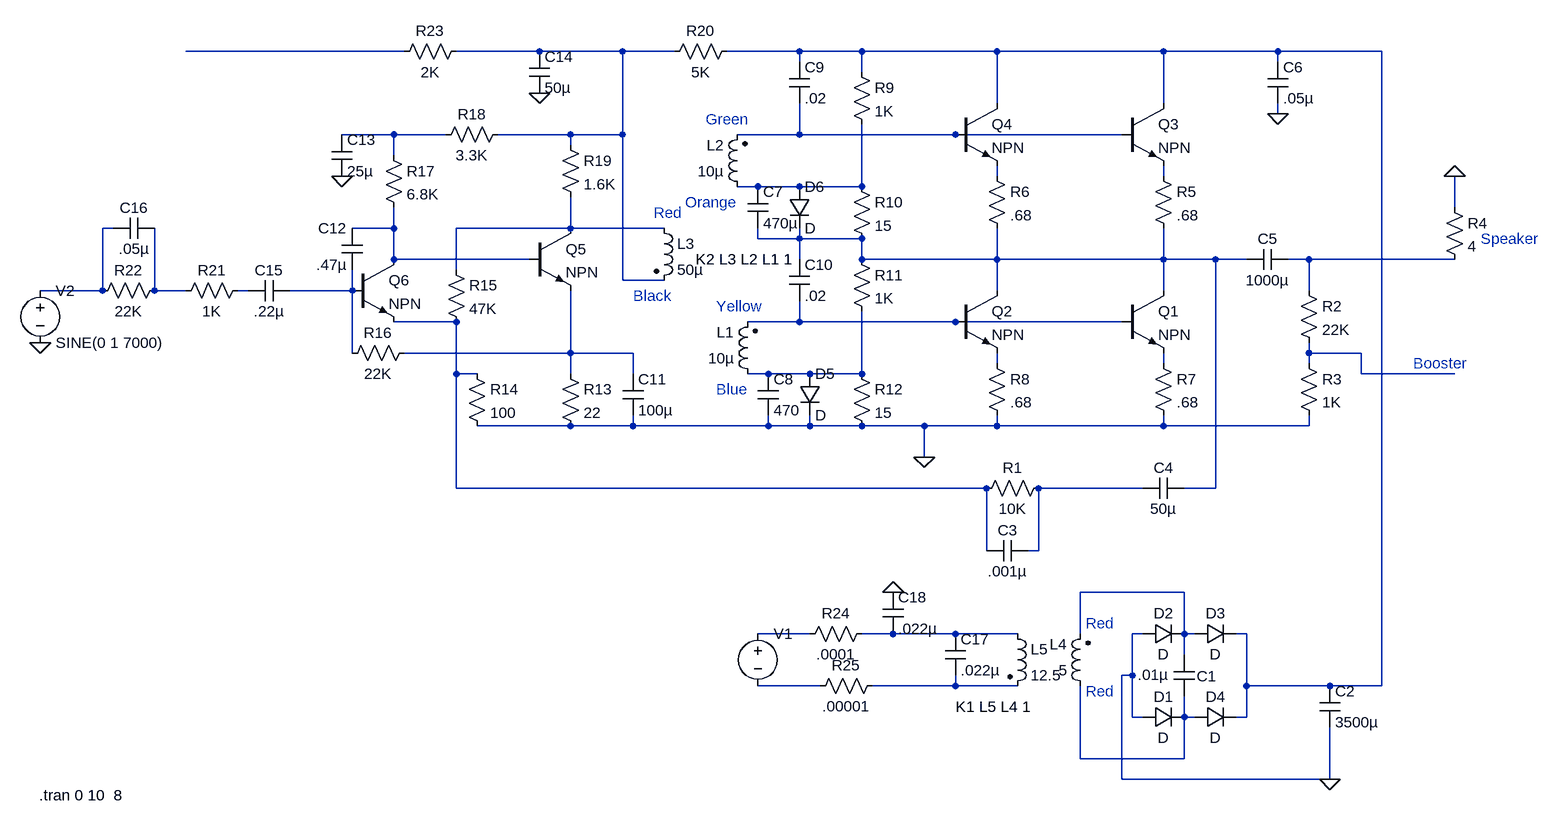
[diagram p0: schematic PA120_power.asc]
PA120_power.asc, the LTspice schematic file:
Version 4
SHEET 1 984 692
WIRE -784 -1568 -1120 -1568
WIRE -576 -1568 -704 -1568
WIRE -448 -1568 -576 -1568
WIRE -368 -1568 -448 -1568
WIRE -176 -1568 -288 -1568
WIRE -80 -1568 -176 -1568
WIRE 128 -1568 -80 -1568
WIRE 384 -1568 128 -1568
WIRE 560 -1568 384 -1568
WIRE 720 -1568 560 -1568
WIRE -176 -1552 -176 -1568
WIRE 560 -1552 560 -1568
WIRE -80 -1536 -80 -1568
WIRE 128 -1488 128 -1568
WIRE 384 -1488 384 -1568
WIRE 560 -1472 560 -1488
WIRE -800 -1440 -880 -1440
WIRE -720 -1440 -800 -1440
WIRE -528 -1440 -640 -1440
WIRE -448 -1440 -448 -1568
WIRE -448 -1440 -528 -1440
WIRE -176 -1440 -176 -1488
WIRE -176 -1440 -272 -1440
WIRE 64 -1440 -176 -1440
WIRE 320 -1440 64 -1440
WIRE -528 -1424 -528 -1440
WIRE -800 -1408 -800 -1440
WIRE 128 -1376 128 -1392
WIRE 384 -1376 384 -1392
WIRE -240 -1360 -272 -1360
WIRE -176 -1360 -240 -1360
WIRE -80 -1360 -80 -1456
WIRE -80 -1360 -176 -1360
WIRE 832 -1328 832 -1376
WIRE -1232 -1296 -1248 -1296
WIRE -800 -1296 -800 -1328
WIRE -800 -1296 -864 -1296
WIRE -528 -1296 -528 -1344
WIRE -528 -1296 -704 -1296
WIRE -384 -1296 -528 -1296
WIRE -240 -1280 -240 -1296
WIRE -176 -1280 -176 -1296
WIRE -176 -1280 -240 -1280
WIRE -80 -1280 -176 -1280
WIRE -800 -1248 -800 -1296
WIRE -592 -1248 -800 -1248
WIRE -176 -1248 -176 -1280
WIRE -80 -1248 -80 -1280
WIRE 128 -1248 128 -1296
WIRE 128 -1248 -80 -1248
WIRE 384 -1248 384 -1296
WIRE 384 -1248 128 -1248
WIRE 464 -1248 384 -1248
WIRE 512 -1248 464 -1248
WIRE 608 -1248 576 -1248
WIRE 832 -1248 608 -1248
WIRE -704 -1232 -704 -1296
WIRE -448 -1216 -448 -1440
WIRE -384 -1216 -448 -1216
WIRE -1248 -1200 -1248 -1296
WIRE -1248 -1200 -1344 -1200
WIRE -1168 -1200 -1168 -1296
WIRE -1120 -1200 -1168 -1200
WIRE -1024 -1200 -1040 -1200
WIRE -864 -1200 -864 -1232
WIRE -864 -1200 -960 -1200
WIRE 128 -1200 128 -1248
WIRE 384 -1200 384 -1248
WIRE 608 -1200 608 -1248
WIRE -704 -1152 -800 -1152
WIRE -176 -1152 -176 -1184
WIRE -176 -1152 -256 -1152
WIRE 64 -1152 -176 -1152
WIRE 320 -1152 64 -1152
WIRE -864 -1104 -864 -1200
WIRE -528 -1104 -528 -1200
WIRE -528 -1104 -784 -1104
WIRE -432 -1104 -528 -1104
WIRE 608 -1104 608 -1120
WIRE 688 -1104 608 -1104
WIRE 128 -1088 128 -1104
WIRE 384 -1088 384 -1104
WIRE 608 -1088 608 -1104
WIRE -704 -1072 -704 -1152
WIRE -672 -1072 -704 -1072
WIRE -528 -1072 -528 -1104
WIRE -432 -1072 -432 -1104
WIRE -224 -1072 -256 -1072
WIRE -160 -1072 -224 -1072
WIRE -80 -1072 -80 -1168
WIRE -80 -1072 -160 -1072
WIRE 688 -1072 688 -1104
WIRE 832 -1072 688 -1072
WIRE -528 -992 -672 -992
WIRE -432 -992 -432 -1008
WIRE -432 -992 -528 -992
WIRE -224 -992 -224 -1008
WIRE -224 -992 -432 -992
WIRE -160 -992 -160 -1008
WIRE -160 -992 -224 -992
WIRE -80 -992 -160 -992
WIRE 16 -992 -80 -992
WIRE 128 -992 128 -1008
WIRE 128 -992 16 -992
WIRE 384 -992 384 -1008
WIRE 384 -992 128 -992
WIRE 608 -992 608 -1008
WIRE 608 -992 384 -992
WIRE 16 -944 16 -992
WIRE -704 -896 -704 -1072
WIRE 112 -896 -704 -896
WIRE 352 -896 192 -896
WIRE 464 -896 464 -1248
WIRE 464 -896 416 -896
WIRE 112 -800 112 -896
WIRE 192 -800 192 -896
WIRE 192 -800 176 -800
WIRE 416 -736 256 -736
WIRE -160 -672 -240 -672
WIRE -32 -672 -80 -672
WIRE 64 -672 -32 -672
WIRE 160 -672 64 -672
WIRE 256 -672 256 -736
WIRE 352 -672 336 -672
WIRE 416 -672 416 -736
WIRE 432 -672 416 -672
WIRE 512 -672 496 -672
WIRE 416 -640 416 -672
WIRE 336 -608 336 -672
WIRE 336 -608 320 -608
WIRE -144 -592 -240 -592
WIRE 64 -592 64 -608
WIRE 64 -592 -64 -592
WIRE 160 -592 64 -592
WIRE 512 -592 512 -672
WIRE 640 -592 512 -592
WIRE 720 -592 720 -1568
WIRE 720 -592 640 -592
WIRE 336 -544 336 -608
WIRE 352 -544 336 -544
WIRE 416 -544 416 -576
WIRE 432 -544 416 -544
WIRE 512 -544 512 -592
WIRE 512 -544 496 -544
WIRE 256 -480 256 -592
WIRE 416 -480 416 -544
WIRE 416 -480 256 -480
WIRE 320 -448 320 -608
WIRE 640 -448 640 -528
WIRE 640 -448 320 -448
FLAG 640 -448 0
FLAG 832 -1376 0
FLAG 16 -944 0
FLAG 560 -1472 0
FLAG -880 -1376 0
FLAG -576 -1504 0
FLAG -32 -736 0
FLAG -1344 -1120 0
SYMBOL diode 352 -528 R270
WINDOW 0 32 32 VTop 0
WINDOW 3 0 32 VBottom 0
SYMATTR InstName D1
SYMBOL diode 352 -656 R270
WINDOW 0 32 32 VTop 0
WINDOW 3 0 32 VBottom 0
SYMATTR InstName D2
SYMBOL diode 432 -656 R270
WINDOW 0 32 32 VTop 0
WINDOW 3 0 32 VBottom 0
SYMATTR InstName D3
SYMBOL diode 432 -528 R270
WINDOW 0 32 32 VTop 0
WINDOW 3 0 32 VBottom 0
SYMATTR InstName D4
SYMBOL cap 400 -640 R0
WINDOW 0 35 33 Left 0
WINDOW 3 -56 31 Left 0
SYMATTR InstName C1
SYMATTR Value .01µ
SYMATTR SpiceLine V=1000
SYMBOL cap 624 -592 R0
SYMATTR InstName C2
SYMATTR Value 3500µ
SYMATTR SpiceLine V=80
SYMBOL cap 176 -816 R90
WINDOW 0 0 32 VBottom 0
WINDOW 3 32 32 VTop 0
SYMATTR InstName C3
SYMATTR Value .001µ
SYMBOL res 208 -912 R90
WINDOW 0 0 56 VBottom 0
WINDOW 3 32 56 VTop 0
SYMATTR InstName R1
SYMATTR Value 10K
SYMBOL cap 416 -912 R90
WINDOW 0 0 32 VBottom 0
WINDOW 3 32 32 VTop 0
SYMATTR InstName C4
SYMATTR Value 50µ
SYMATTR SpiceLine V=50
SYMBOL cap 576 -1264 R90
WINDOW 0 0 32 VBottom 0
WINDOW 3 32 32 VTop 0
SYMATTR InstName C5
SYMATTR Value 1000µ
SYMATTR SpiceLine V=50
SYMBOL res 592 -1216 R0
SYMATTR InstName R2
SYMATTR Value 22K
SYMBOL res 592 -1104 R0
SYMATTR InstName R3
SYMATTR Value 1K
SYMBOL res 816 -1344 R0
SYMATTR InstName R4
SYMATTR Value 4
SYMBOL npn2 320 -1200 R0
SYMATTR InstName Q1
SYMBOL npn2 64 -1200 R0
SYMATTR InstName Q2
SYMBOL npn2 320 -1488 R0
SYMATTR InstName Q3
SYMBOL npn2 64 -1488 R0
SYMATTR InstName Q4
SYMBOL res 368 -1392 R0
SYMATTR InstName R5
SYMATTR Value .68
SYMATTR SpiceLine pwr=10
SYMBOL res 112 -1392 R0
SYMATTR InstName R6
SYMATTR Value .68
SYMATTR SpiceLine pwr=10
SYMBOL res 368 -1104 R0
SYMATTR InstName R7
SYMATTR Value .68
SYMATTR SpiceLine pwr=10
SYMBOL res 112 -1104 R0
SYMATTR InstName R8
SYMATTR Value .68
SYMATTR SpiceLine pwr=10
SYMBOL cap 544 -1552 R0
SYMATTR InstName C6
SYMATTR Value .05µ
SYMBOL res -96 -1552 R0
SYMATTR InstName R9
SYMATTR Value 1K
SYMATTR SpiceLine pwr=5
SYMBOL res -96 -1376 R0
SYMATTR InstName R10
SYMATTR Value 15
SYMBOL res -96 -1264 R0
SYMATTR InstName R11
SYMATTR Value 1K
SYMATTR SpiceLine pwr=5
SYMBOL res -96 -1088 R0
SYMATTR InstName R12
SYMATTR Value 15
SYMBOL diode -176 -1072 R0
SYMATTR InstName D5
SYMBOL diode -192 -1360 R0
SYMATTR InstName D6
SYMBOL cap -256 -1360 R0
SYMATTR InstName C7
SYMATTR Value 470µ
SYMATTR SpiceLine V=6
SYMBOL cap -240 -1072 R0
SYMATTR InstName C8
SYMATTR Value 470
SYMATTR SpiceLine V=6
SYMBOL ind2 -240 -1056 R180
WINDOW 0 36 80 Left 0
WINDOW 3 36 40 Left 0
SYMATTR InstName L1
SYMATTR Value 10µ
SYMATTR Type ind
SYMBOL ind2 -256 -1344 R180
WINDOW 0 36 80 Left 0
WINDOW 3 36 40 Left 0
SYMATTR InstName L2
SYMATTR Value 10µ
SYMATTR Type ind
SYMBOL cap -192 -1552 R0
SYMATTR InstName C9
SYMATTR Value .02
SYMBOL cap -192 -1248 R0
SYMATTR InstName C10
SYMATTR Value .02
SYMBOL ind2 -400 -1312 R0
SYMATTR InstName L3
SYMATTR Value 50µ
SYMATTR Type ind
SYMBOL npn3 -592 -1296 R0
SYMATTR InstName Q5
SYMBOL npn3 -864 -1248 R0
SYMATTR InstName Q6
SYMBOL res -544 -1088 R0
SYMATTR InstName R13
SYMATTR Value 22
SYMBOL cap -448 -1072 R0
SYMATTR InstName C11
SYMATTR Value 100µ
SYMATTR SpiceLine V=25
SYMBOL res -688 -1088 R0
SYMATTR InstName R14
SYMATTR Value 100
SYMBOL res -720 -1248 R0
SYMATTR InstName R15
SYMATTR Value 47K
SYMBOL res -768 -1120 R90
WINDOW 0 0 56 VBottom 0
WINDOW 3 32 56 VTop 0
SYMATTR InstName R16
SYMATTR Value 22K
SYMBOL cap -848 -1232 R180
WINDOW 0 24 64 Left 0
WINDOW 3 24 8 Left 0
SYMATTR InstName C12
SYMATTR Value .47µ
SYMBOL res -816 -1424 R0
SYMATTR InstName R17
SYMATTR Value 6.8K
SYMBOL cap -896 -1440 R0
SYMATTR InstName C13
SYMATTR Value 25µ
SYMATTR SpiceLine V=25
SYMBOL res -624 -1456 R90
WINDOW 0 0 56 VBottom 0
WINDOW 3 32 56 VTop 0
SYMATTR InstName R18
SYMATTR Value 3.3K
SYMBOL res -544 -1440 R0
SYMATTR InstName R19
SYMATTR Value 1.6K
SYMATTR SpiceLine pwr=28
SYMBOL cap -592 -1568 R0
SYMATTR InstName C14
SYMATTR Value 50µ
SYMATTR SpiceLine V=50
SYMBOL res -272 -1584 R90
WINDOW 0 0 56 VBottom 0
WINDOW 3 32 56 VTop 0
SYMATTR InstName R20
SYMATTR Value 5K
SYMBOL cap -960 -1216 R90
WINDOW 0 0 32 VBottom 0
WINDOW 3 32 32 VTop 0
SYMATTR InstName C15
SYMATTR Value .22µ
SYMBOL res -1024 -1216 R90
WINDOW 0 0 56 VBottom 0
WINDOW 3 32 56 VTop 0
SYMATTR InstName R21
SYMATTR Value 1K
SYMBOL res -1152 -1216 R90
WINDOW 0 0 56 VBottom 0
WINDOW 3 32 56 VTop 0
SYMATTR InstName R22
SYMATTR Value 22K
SYMBOL cap -1168 -1312 R90
WINDOW 0 0 32 VBottom 0
WINDOW 3 32 32 VTop 0
SYMATTR InstName C16
SYMATTR Value .05µ
SYMBOL res -688 -1584 R90
WINDOW 0 0 56 VBottom 0
WINDOW 3 32 56 VTop 0
SYMATTR InstName R23
SYMATTR Value 2K
SYMATTR SpiceLine pwr=5
SYMBOL ind2 272 -576 R180
WINDOW 0 36 80 Left 0
WINDOW 3 36 40 Left 0
SYMATTR InstName L4
SYMATTR Value 5
SYMATTR Type ind
SYMBOL ind2 144 -688 R0
SYMATTR InstName L5
SYMATTR Value 12.5
SYMATTR Type ind
SYMBOL cap 48 -672 R0
SYMATTR InstName C17
SYMATTR Value .022µ
SYMATTR SpiceLine V=150
SYMBOL cap -48 -736 R0
SYMATTR InstName C18
SYMATTR Value .022µ
SYMATTR SpiceLine V=600
SYMBOL voltage -240 -688 R0
WINDOW 3 24 104 Invisible 0
WINDOW 123 0 0 Left 0
WINDOW 39 0 0 Left 0
SYMATTR InstName V1
SYMATTR Value SINE(0 120 60)
SYMBOL res -64 -688 R90
WINDOW 0 0 56 VBottom 0
WINDOW 3 32 56 VTop 0
SYMATTR InstName R24
SYMATTR Value .0001
SYMBOL res -48 -608 R90
WINDOW 0 0 56 VBottom 0
WINDOW 3 32 56 VTop 0
SYMATTR InstName R25
SYMATTR Value .00001
SYMBOL voltage -1344 -1216 R0
WINDOW 123 0 0 Left 0
WINDOW 39 0 0 Left 0
SYMATTR InstName V2
SYMATTR Value SINE(0 1 7000)
TEXT 768 -1088 Left 0 ;Booster
TEXT 872 -1280 Left 0 ;Speaker
TEXT -400 -1320 Left 0 ;Red
TEXT -432 -1192 Left 0 ;Black
TEXT -320 -1464 Left 0 ;Green
TEXT -352 -1336 Left 0 ;Orange
TEXT -304 -1176 Left 0 ;Yellow
TEXT -304 -1048 Left 0 ;Blue
TEXT 264 -688 Left 0 ;Red
TEXT 264 -584 Left 0 ;Red
TEXT 64 -560 Left 0 !K1 L5 L4 1
TEXT -336 -1248 Left 0 !K2 L3 L2 L1 1
TEXT -1346 -424 Left 0 !.tran 0 10  8

The netlist it stands for:
* PA120_power.asc
D1 0 N030 D
D2 0 N025 D
D3 N025 N003 D
D4 N030 N003 D
C1 N025 N030 .01µ V=1000
C2 N003 0 3500µ V=80
C3 N024 N017 .001µ
R1 N024 N017 10K
C4 N012 N024 50µ V=50
C5 N013 N012 1000µ V=50
R2 N013 N020 22K
R3 N020 0 1K
R4 0 N013 4
Q1 N012 N018 N022 0 NPN
Q2 N012 N018 N021 0 NPN
Q3 N003 N005 N007 0 NPN
Q4 N003 N005 N006 0 NPN
R5 N007 N012 .68 pwr=10
R6 N006 N012 .68 pwr=10
R7 N022 0 .68 pwr=10
R8 N021 0 .68 pwr=10
C6 N003 0 .05µ
R9 N003 N008 1K pwr=5
R10 N008 N012 15
R11 N012 N023 1K pwr=5
R12 N023 0 15
D5 N023 0 D
D6 N008 N012 D
C7 N008 N012 470µ V=6
C8 N023 0 470 V=6
L1 N023 N018 10µ
L2 N008 N005 10µ
C9 N003 N005 .02
C10 N012 N018 .02
L3 N011 N002 50µ
Q5 N011 N010 N019 0 NPN
Q6 N010 N016 N017 0 NPN
R13 N019 0 22
C11 N019 0 100µ V=25
R14 N017 0 100
R15 N011 N017 47K
R16 N019 N016 22K
C12 N016 N010 .47µ
R17 N004 N010 6.8K
C13 N004 0 25µ V=25
R18 N002 N004 3.3K
R19 N002 N011 1.6K pwr=28
C14 N002 0 50µ V=50
R20 N003 N002 5K
C15 N016 N015 .22µ
R21 N015 N014 1K
R22 N014 N009 22K
C16 N014 N009 .05µ
R23 N002 N001 2K pwr=5
L4 N030 N025 5
L5 N027 N029 12.5
C17 N027 N029 .022µ V=150
C18 0 N027 .022µ V=600
V1 N026 N028 SINE(0 120 60)
R24 N027 N026 .0001
R25 N029 N028 .00001
V2 N009 0 SINE(0 1 7000)
.model D D
.lib standard.dio
.model NPN NPN
.model PNP PNP
.lib standard.bjt
* Booster
* Speaker
* Red
* Black
* Green
* Orange
* Yellow
* Blue
* Red
* Red
K1 L5 L4 1
K2 L3 L2 L1 1
.tran 0 10  8
.backanno
.end